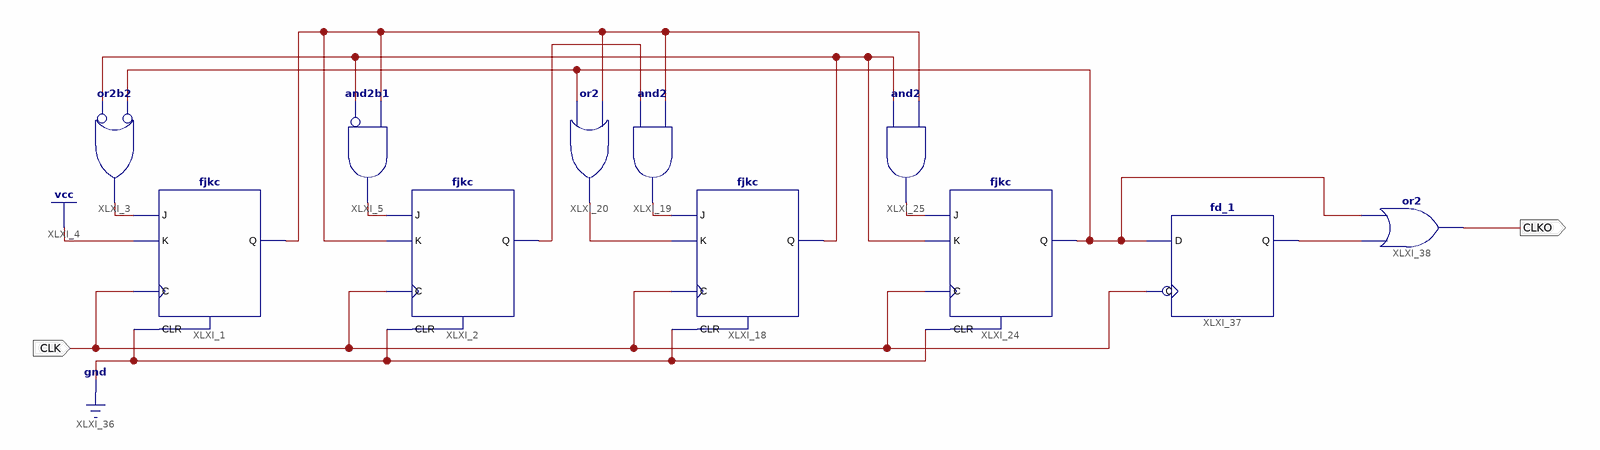
[diagram p0: schematic sheet 1]
// Xilinx ISE schematic clkdiv11.sch (spartan6) as structural Verilog: 11 symbols, 2 ports
module clkdiv11 (
  input  CLK,
  output CLKO
);

  wire XLXN_2, XLXN_5, XLXN_6, XLXN_7, XLXN_9, XLXN_12, XLXN_13, XLXN_15, XLXN_18, XLXN_38;

  fjkc XLXI_1 (.C(CLK), .CLR(1'b0), .J(XLXN_2), .K(1'b1), .Q(XLXN_7));
  or XLXI_3 (XLXN_2, ~XLXN_5, ~XLXN_6);  // or2b2
  fjkc XLXI_2 (.C(CLK), .CLR(1'b0), .J(XLXN_18), .K(XLXN_7), .Q(XLXN_12));
  and XLXI_5 (XLXN_18, ~XLXN_5, XLXN_7);  // and2b1
  fjkc XLXI_18 (.C(CLK), .CLR(1'b0), .J(XLXN_9), .K(XLXN_13), .Q(XLXN_5));
  and XLXI_19 (XLXN_9, XLXN_12, XLXN_7);
  or XLXI_20 (XLXN_13, XLXN_6, XLXN_7);
  fjkc XLXI_24 (.C(CLK), .CLR(1'b0), .J(XLXN_15), .K(XLXN_5), .Q(XLXN_6));
  and XLXI_25 (XLXN_15, XLXN_5, XLXN_7);
  fd_1 XLXI_37 (.C(CLK), .D(XLXN_6), .Q(XLXN_38));
  or XLXI_38 (CLKO, XLXN_38, XLXN_6);
endmodule
